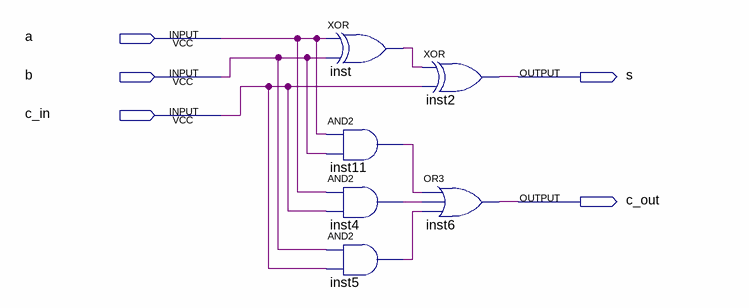
[diagram p0: schematic sheet]
// Quartus schematic SOMADOR.bdf as structural Verilog: 6 symbols, 5 pins
module SOMADOR (
  input  a,
  input  b,
  input  c_in,
  output s,
  output c_out
);

  wire inst4_out, inst5_out, inst11_out, inst_out;

  xor inst (inst_out, a, b);
  and inst11 (inst11_out, a, b);
  and inst4 (inst4_out, a, c_in);
  and inst5 (inst5_out, b, c_in);
  xor inst2 (s, inst_out, c_in);
  or inst6 (c_out, inst11_out, inst4_out, inst5_out);
endmodule
